# EAGLE design solarrainbow (EAGLE 5.06)
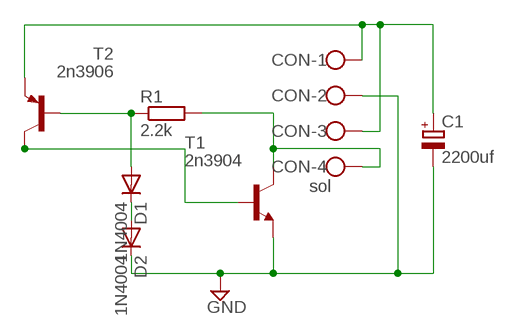
[diagram p0: schematic, sheet 1]

## Parts
C1  2200uf  CPOL-EUE7.5-18  [E7,5-18]
CON  sol  W237-4  [W237-4]
D1  1N4004  [DO41-10]
D2  1N4004  [DO41-10]
R1  2.2k  R-EU_0309/10  [0309/10]
T1  2n3904  -NPN-TO92-EBC  [TO92-EBC]
T2  2n3906  -PNP-TO92-EBC  [TO92-EBC]

## Nets
GND [fatter]: C1.- CON.2 D2.C T1.E
N$1 [fatter]: C1.+ CON.1 CON.3 T2.E
N$2 [fatter]: CON.4 R1.2 T1.C
N$3 [fatter]: D1.A R1.1 T2.B
N$4 [fatter]: D1.C D2.A
N$5 [fatter]: T1.B T2.C

## Library data of the parts
C1 = resistor:CPOL-EU: POLARIZED CAPACITOR, European symbol
CON = con-wago-500:W237-4: WAGO SCREW CLAMP
D1 D2 = diode:1N4004: DIODE general purpose rectifier, 1 A
R1 = rcl:R-EU_: RESISTOR, European symbol
T1 = transistor-neu-to92:*-NPN-: NPN Transistror
T2 = transistor-neu-to92:*-PNP-: PNP Transistror

## Net classes
1 fatter: width 1 mm, drill 0.5 mm, clearance 0.5 mm

## Board
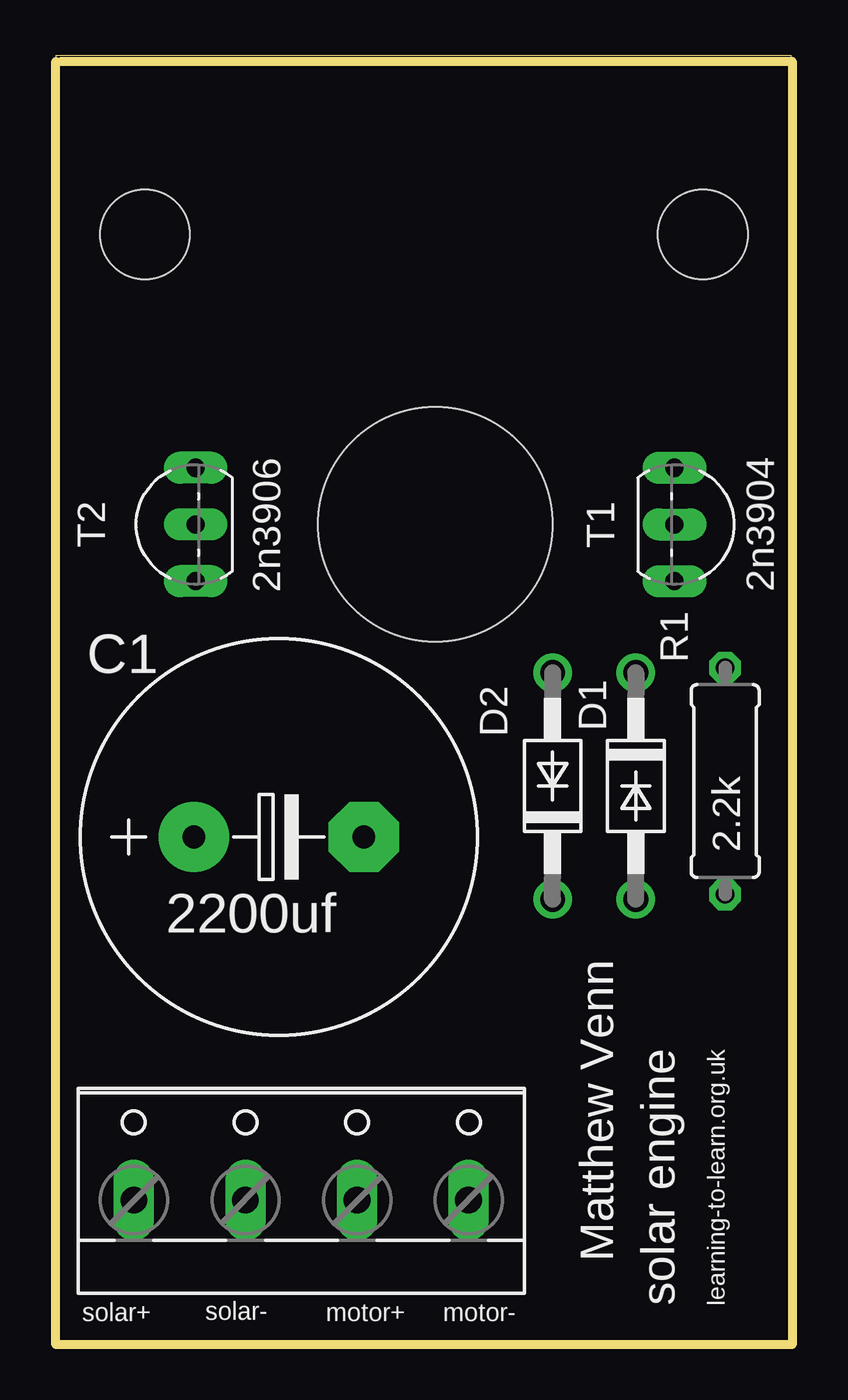
[diagram p1: board, top side]
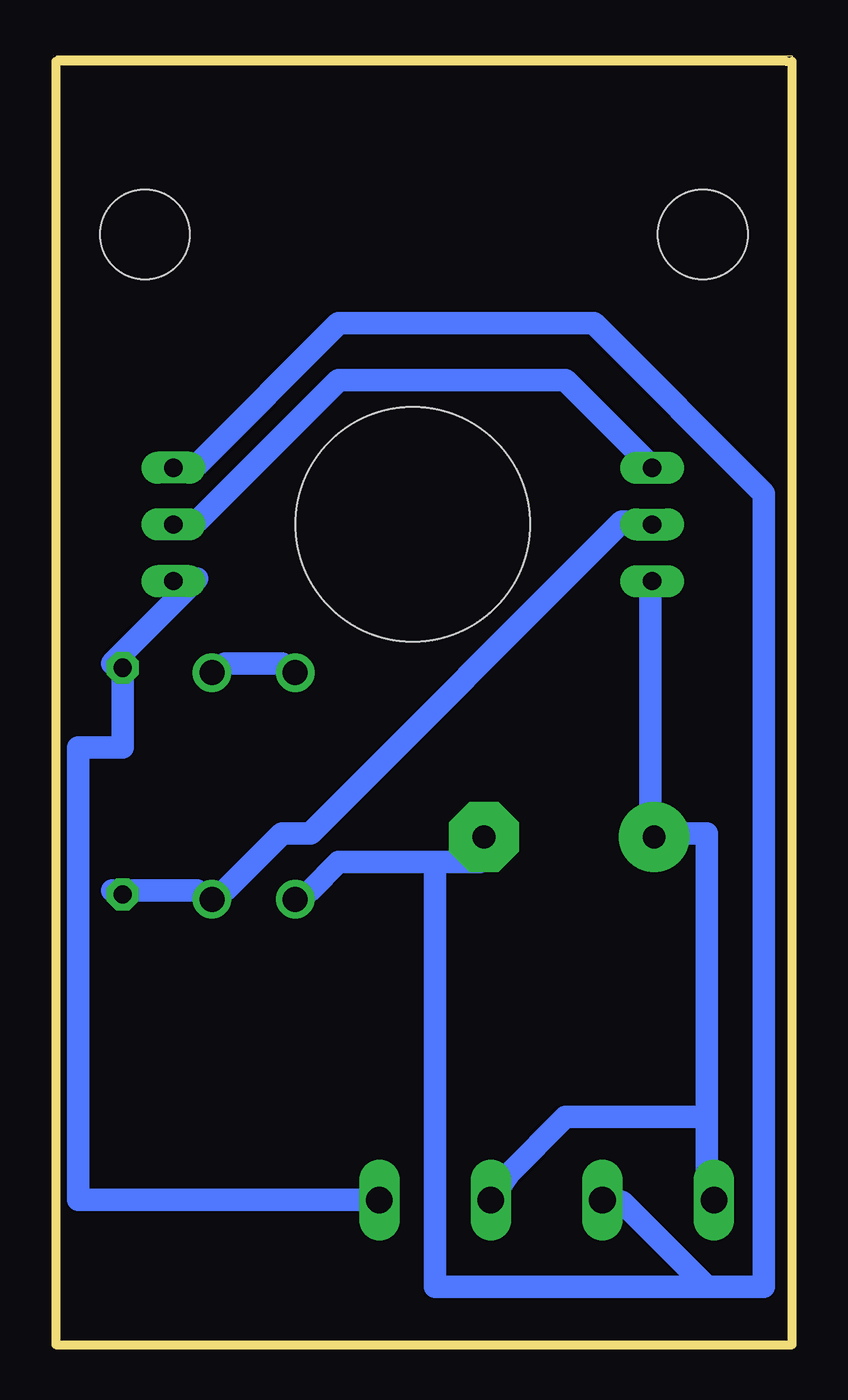
[diagram p2: board, bottom side, seen from below]

Size 32.96 x 57.71 mm. Coordinates in mm from the lower left corner, seen from the top.
Outline: 0,0 32.96,0 32.96,57.71 0,57.71 0,0
Copper layers (1*16): Top 0.035mm / dielectric 1.5mm / Bottom 0.035mm
Design rules "SparkFun": minimum track width 8mil, minimum drill 20mil, track to track 8mil, track to pad 8mil, pad to pad 8mil, via to via 8mil, smd to smd 8mil, copper to edge 10mil, drill to drill 8mil, minimum pad ring 12mil, minimum via ring 10mil, stop-mask expansion 4mil, vias tented up to drill 25mil, thermal gap 10mil
Holes 10.5 mm at 17,36.71
Holes 4 mm at 4,49.71 29,49.71
Milling: 4 lines

### Footprints (pad centres in the part's own frame; a part is rotated, then mirrored left to right if it is on the bottom)
E7,5-18 = drill 1.016 pad 3.15 round: + -3.81,0 | drill 1.016 pad 3.15 octagon: - 3.81,0
W237-4 = drill 1.194 long: 1 -7.5,-1.27; 2 -2.5,-1.27; 3 2.5,-1.27; 4 7.5,-1.27
DO41-10 = drill 1.118 round: A 5.08,0; C -5.08,0
0309/10 = drill 0.813 octagon: 1 -5.08,0; 2 5.08,0
TO92-EBC = drill 0.813 long: B 0,-1.27; C 2.54,-1.27; E -2.54,-1.27

### Placement (x,y rotation side)
C1  10,22.71 0 top
CON  11,7.71 0 top
D1  26,24.99 270 top
D2  22.27,24.99 90 top
R1  30,25.21 90 top
T1  29,36.71 270 top
T2  5,36.71 90 top

### Tracks (layer width: path | path; a pad name or v marks a point on that pad's centre or on a via)
GND
  Bottom 1: 16,21.59 13.97,21.59 C1.- | 16,21.59 20.32,21.59 21.59,20.32 D2.C | 3.81,2.54 1.27,2.54 1.27,38.1 8.89,45.72 20.32,45.72 26.67,39.37 T1.E | 3.81,2.54 7.62,6.35 CON.2 | 3.81,2.54 16,2.54 16,21.59
N$1
  Bottom 1: T2.E 6.35,34.29 6.35,22.86 C1.+ 5.08,22.86 3.81,22.86 3.81,10.16 | 3.81,10.16 3.81,7.62 CON.1 | 3.81,10.16 10.16,10.16 12.7,7.62 CON.3
N$2
  Bottom 1: T1.C 26.67,34.29 30.48,30.48 R1.2 30,26.71 32,26.71 32,6.44 CON.4
N$3
  Bottom 1: T2.B 6.35,36.83 7.62,36.83 21.59,22.86 22.86,22.86 25.4,20.32 D1.A 26.67,20.32 30.48,20.32 R1.1
N$4
  Bottom 1: D2.A 22.86,30.48 25.4,30.48 D1.C
N$5
  Bottom 1: T2.C 6.35,39.37 10.16,43.18 20.32,43.18 26.67,36.83 T1.B

### Text on the board
tPlace: Matthew Venn | solar engine | learning-to-learn.org.uk | solar+ | solar- | motor+ | motor-